# EAGLE design 3.7LiPoly Management 2.1 (EAGLE 9.3.1)
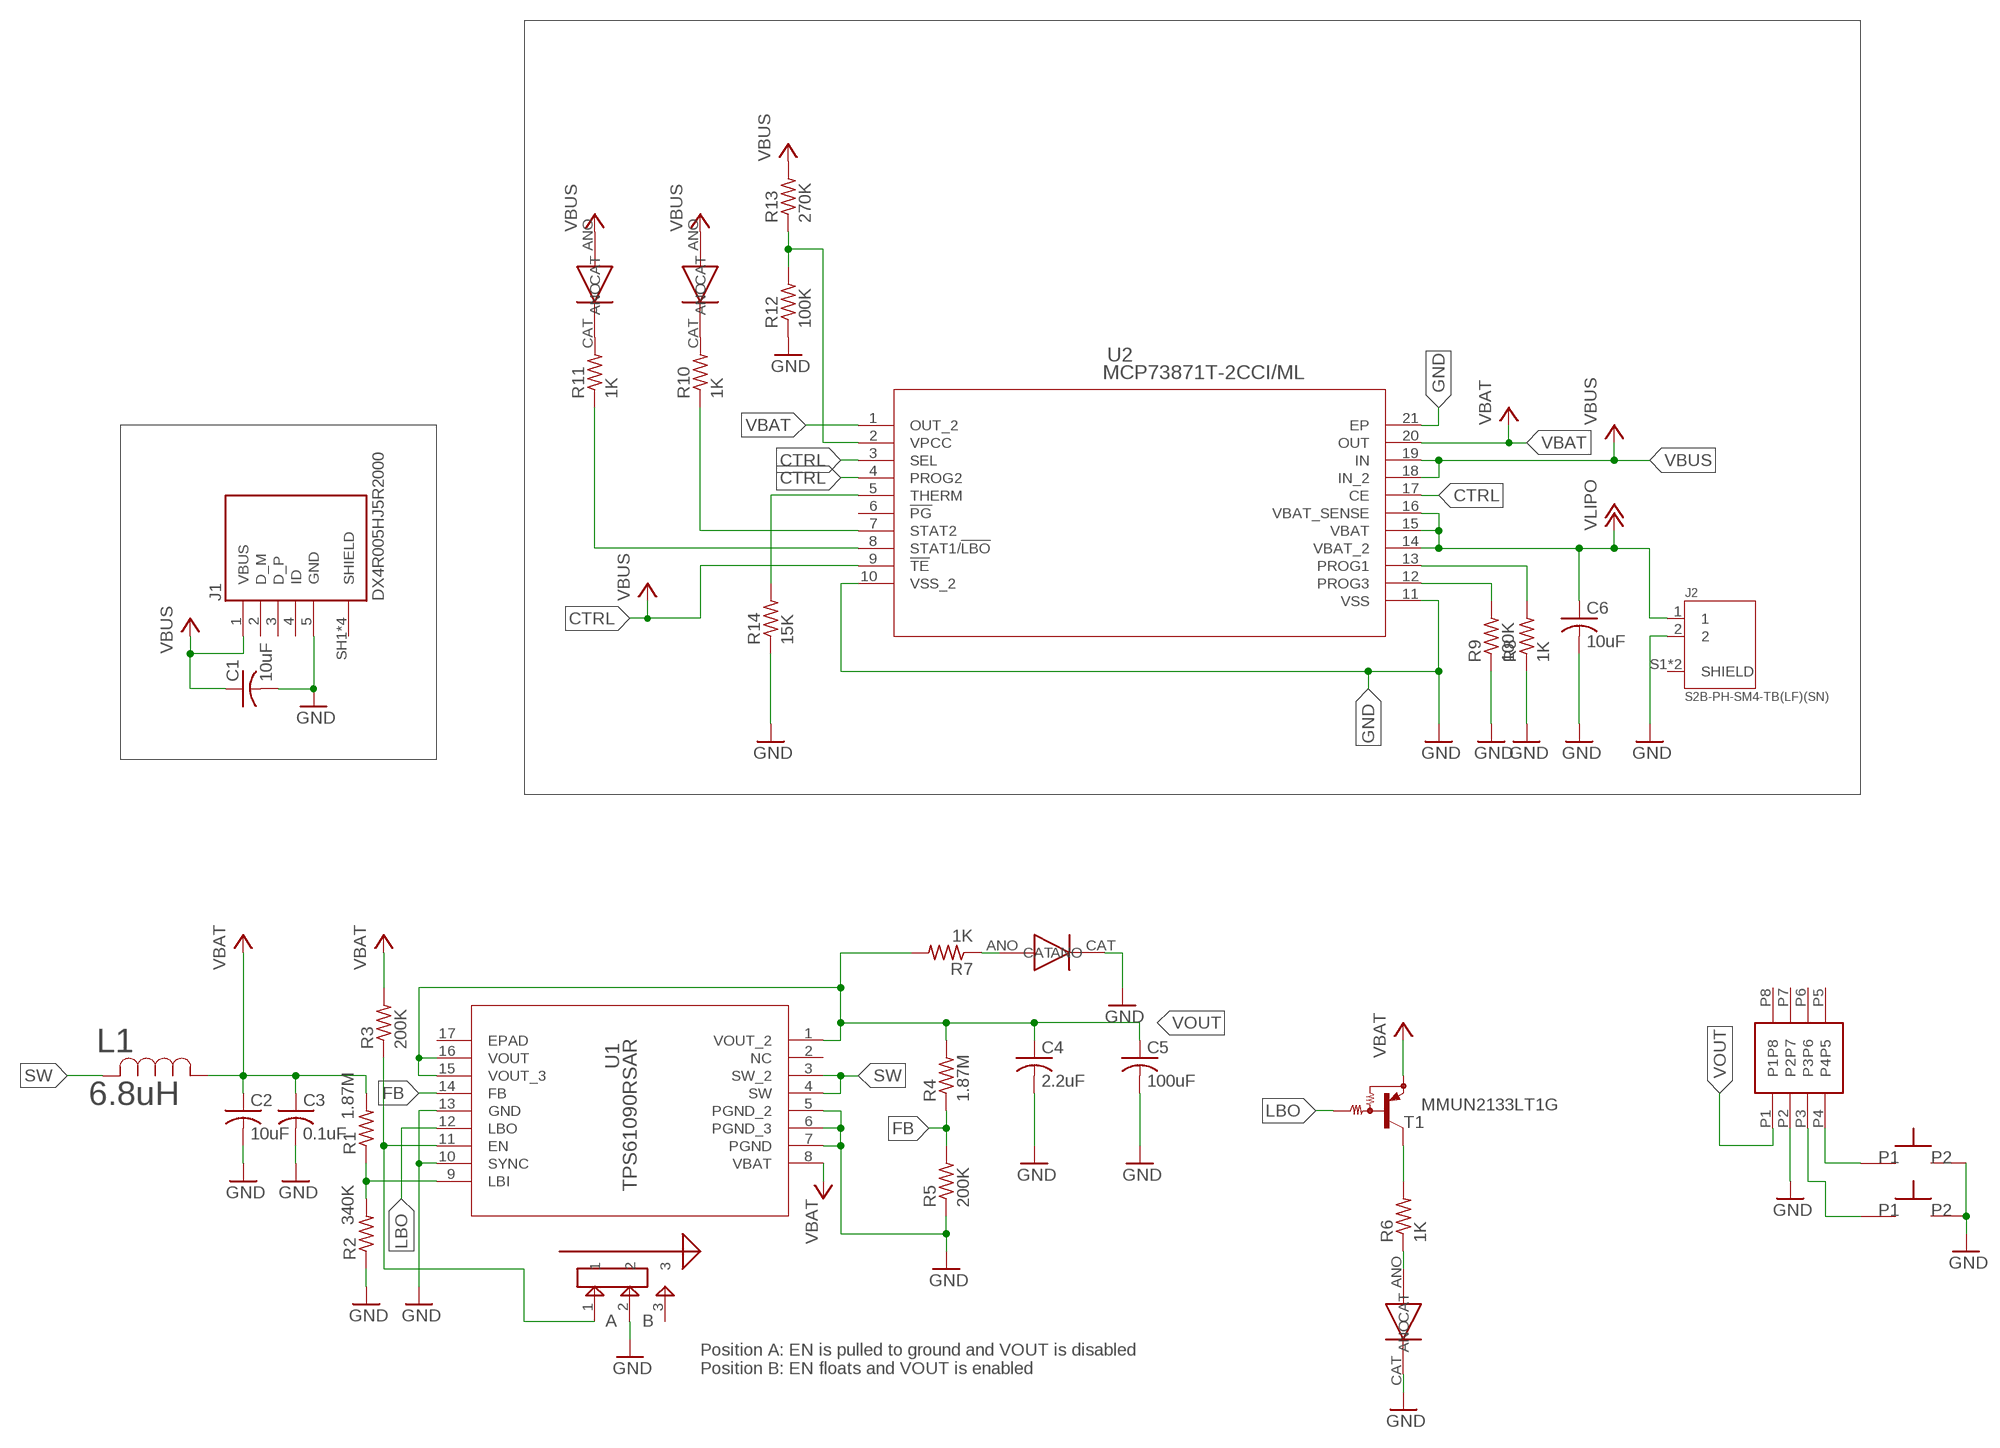
[diagram p0: schematic, sheet 1]

## Parts
C1  10uF  C-USC0805  [C0805]
C2  10uF  C-USC0805  [C0805]
C3  0.1uF  C-USC0805  [C0805]
C4  2.2uF  C-USC0805  [C0805]
C5  100uF  C-USC0805  [C0805]
C6  10uF  C-USC0805  [C0805]
CHARGE  YELLOW  WP934AD  [WP934AD]
DONE  GREEN  WP934AD  [WP934AD]
H1  M22-6340442  [M22-6340442]
J1  DX4R005HJ5R2000  [JAE_DX4R005HJ5R2000]
J2  S2B-PH-SM4-TB(LF)(SN)  [JST_S2B-PH-SM4-TB(LF)(SN)]
L1  6.8uH  VLCF5020T  [IND_5028]
LBO  RED  WP934AD  [WP934AD]
POWERON  BLUE  WP934EW  [WP934EW]
R1  1.87M  R-US_R0805  [R0805]
R2  340K  R-US_R0805  [R0805]
R3  200K  R-US_R0805  [R0805]
R4  1.87M  R-US_R0805  [R0805]
R5  200K  R-US_R0805  [R0805]
R6  1K  R-US_R0805  [R0805]
R7  1K  R-US_R0805  [R0805]
R8  1K  R-US_R0805  [R0805]
R9  100K  R-US_R0805  [R0805]
R10  1K  R-US_R0805  [R0805]
R11  1K  R-US_R0805  [R0805]
R12  100K  R-US_R0805  [R0805]
R13  270K  R-US_R0805  [R0805]
R14  15K  R-US_R0805  [R0805]
T1  MMUN2133LT1G  MUN2114T1-PNP_DRIVER-SC59-BEC  [SC59-BEC]
U1  TPS61090RSAR  [RSA16_2P7X2P7]
U2  MCP73871T-2CCI/ML  [QFN20_4X4MC]
U$1  SPST_TACTILE_SWITCHRIGHTANGLEBENT  [SPST_TACTILESWITCH_TL3360CF185Q_BENTFRAME]
U$2  JS102011SAQN  [JS102011SAQN]
U$3  SPST_TACTILE_SWITCHRIGHTANGLEBENT  [SPST_TACTILESWITCH_TL3360CF185Q_BENTFRAME]

## Nets
+3V3: CHARGE.ANO DONE.ANO R13.2 ; supply symbol labelled VBUS
CTRL: U2.3(SEL) U2.4(PROG2) U2.9(!TE) U2.17(CE) ; supply symbol labelled VBUS
FB: R4.1 R5.2 U1.14(FB)
GND: C1.2 C2.2 C3.2 C4.2 C5.2 C6.2 H1.P2 J1.5(GND) J2.2 LBO.CAT POWERON.CAT R2.1 R5.1 R8.1 R9.1 R12.1 R14.1 U1.5(PGND_2) U1.6(PGND_3) U1.7(PGND) U1.10(SYNC) U1.13(GND) U2.10(VSS_2) U2.11(VSS) U2.21(EP) U$1.P$2 U$2.2 U$3.P$2
LBO: T1.B U1.12(LBO)
N$1: R1.1 R2.2 U1.9(LBI)
N$2: R3.1 U1.11(EN) U$2.1
N$3: CHARGE.CAT R11.2
N$4: R8.2 U2.13(PROG1)
N$5: R6.2 T1.C
N$6: LBO.ANO R6.1
N$7: POWERON.ANO R7.1
N$8: R9.2 U2.12(PROG3)
N$9: DONE.CAT R10.2
N$10: H1.P4 U$3.P$1
N$11: R11.1 U2.8(STAT1/!LBO)
N$12: R10.1 U2.7(STAT2)
N$13: R14.2 U2.5(THERM)
N$14: R12.2 R13.1 U2.2(VPCC)
N$15: H1.P3 U$1.P$1
SW: L1.2 U1.3(SW_2) U1.4(SW)
VBAT [VBAT]: C2.1 C3.1 L1.1 R1.2 R3.2 T1.E U1.8(VBAT) U2.1(OUT_2) U2.20(OUT)
VBUS: C1.1 J1.1(VBUS) U2.18(IN_2) U2.19(IN)
VLIPO: C6.1 J2.1 U2.14(VBAT_2) U2.15(VBAT) U2.16(VBAT_SENSE)
VOUT: C4.1 C5.1 H1.P1 R4.2 R7.2 U1.1(VOUT_2) U1.15(VOUT_3) U1.16(VOUT)
Unconnected: H1.P5 H1.P6 H1.P7 H1.P8 J1.2(D_M) J1.3(D_P) J1.4(ID) J1.SH1(SHIELD) J1.SH2(SHIELD) J1.SH3(SHIELD) J1.SH4(SHIELD) J2.S1(SHIELD) J2.S2(SHIELD) U1.2(NC) U1.17(EPAD) U2.6(!PG) U$2.3

## Notes on the sheet
- A | B
- Position A: EN is pulled to ground and VOUT is disabled
  Position B: EN floats and VOUT is enabled

## Library data of the parts
C1-C6 = rcl:C-US: CAPACITOR, American symbol; SPICEPREFIX: C
CHARGE DONE LBO = KingBright:WP934AD: LED Circuit Board Indicators 3mm RA. CBI LED INDICATOR
H1 = M22-6340442:M22-6340442: 8 Pin Header 2.0mm pitch
J1 = DX4R005HJ5R2000:DX4R005HJ5R2000: RCPT MICRO USB 2.0 B SMT H/D; DESCRIPTION: DX4 series, receptacle, on-board, right-angle standard mount, surface mount; MF: JAE Electronics; MP: DX4R005HJ5R2000; PACKAGE: None
J2 = S2B-PH-SM4-TB_LF__SN_:S2B-PH-SM4-TB(LF)(SN): PH Series 2 Position 2 mm Pitch Surface Mount Side Entry Shrouded Header; DESCRIPTION: PH Series 2 Position 2 mm Pitch Surface Mount Side Entry Shrouded Header; MF: JST Sales; MP: S2B-PH-SM4-TB_LF__SN_; PACKAGE: FakePackage u
L1 = VLCF5020T-6R8N1R1:VLCF5020T
POWERON = KingBright:WP934EW: LED Circuit Board Indicators 3mm RA HOUSING LED
R1-R14 = rcl:R-US_: RESISTOR, American symbol; SPICEPREFIX: R
T1 = transistor:*-PNP_DRIVER-: PNP Bias Resistor Transistor
U1 = TPS61090RSAR:TPS61090RSAR; MANUFACTURER_PART_NUMBER: TPS61090RSAR; VENDOR: Texas Instruments
U2 = MCP73871T-2CCI:MCP73871T-2CCI/ML: Stand-Alone System Load Sharing and Li-Ion/Li-Polymer Battery Charge Management Controller; MANUFACTURER_PART_NUMBER: MCP73871T2CCIML; VENDOR: Microchip
U$1 U$3 = switches:SPST_TACTILE_SWITCH: SMD SPST Tactile Switch
U$2 = JS102011SAQN:JS102011SAQN: SPDT SMD Right Angle Switch

## Board
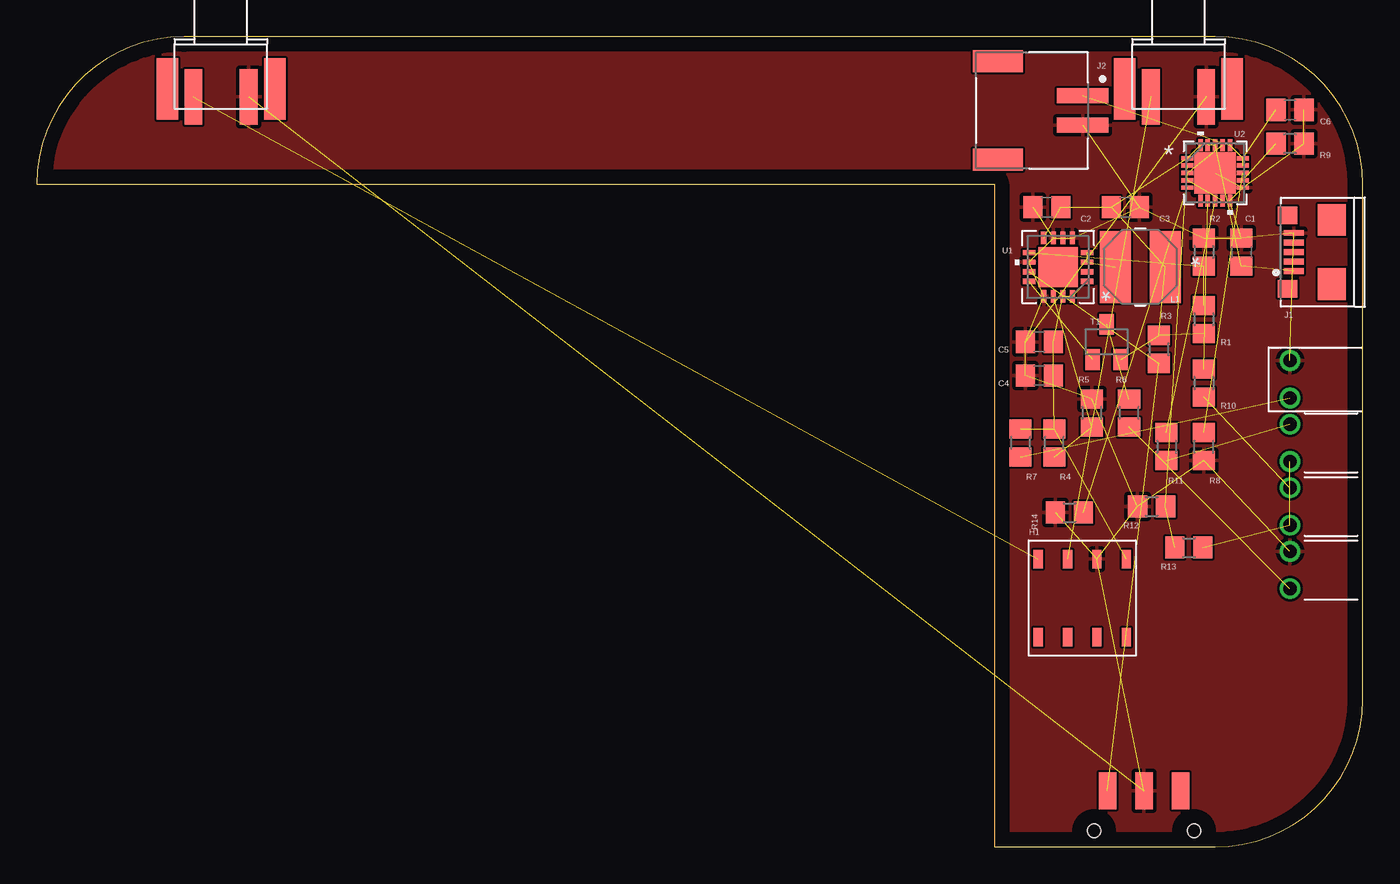
[diagram p1: board, top side]
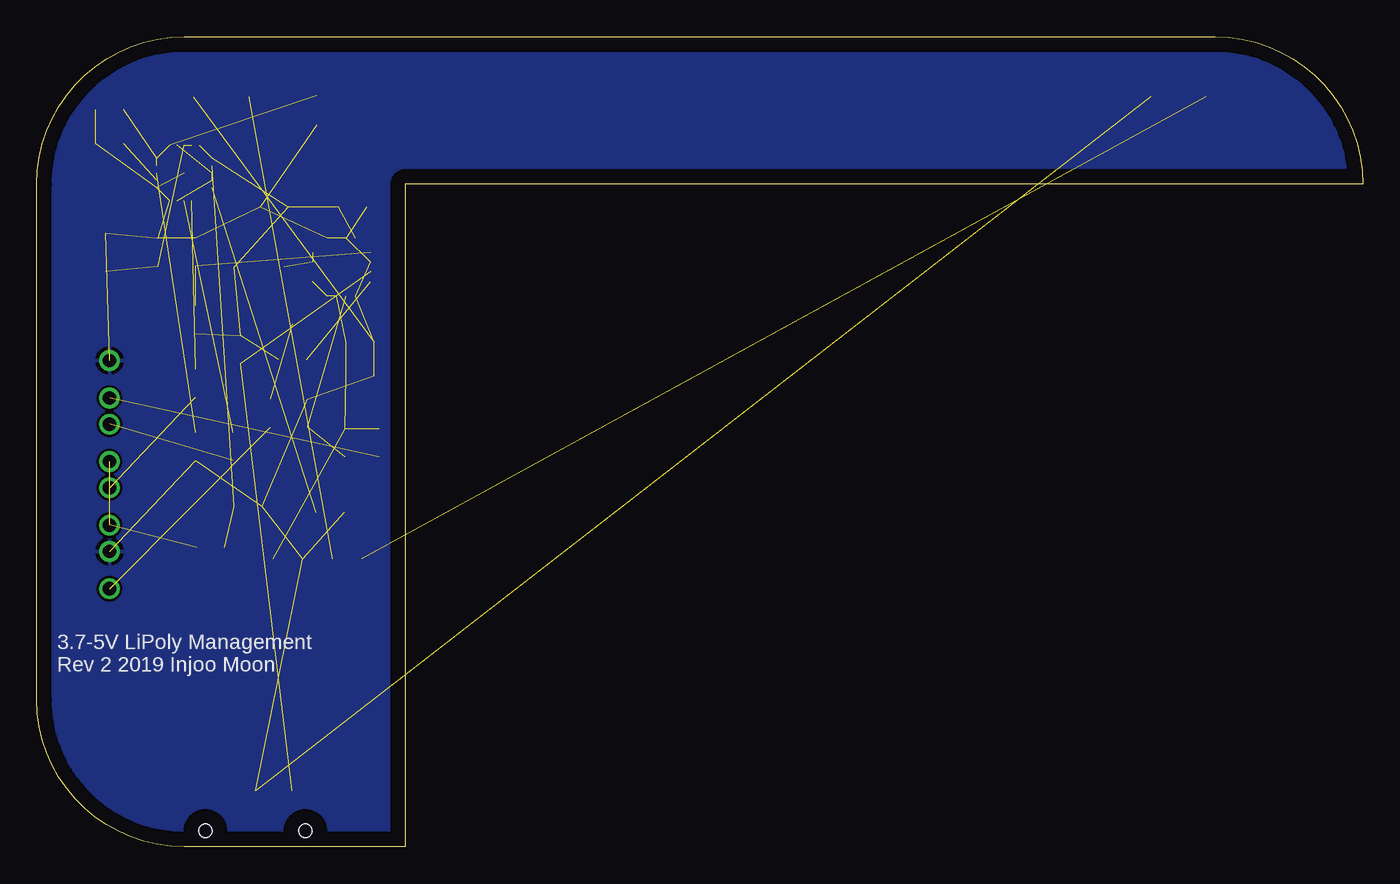
[diagram p2: board, bottom side, seen from below]

Size 90 x 55 mm. Coordinates in mm from the lower left corner, seen from the top.
Outline: 65,0 80,0 arc90 90,10 90,45 arc90 80,55 10,55 arc90 0,45 65,45 65,0
Copper layers (1*16): Top 0.035mm / dielectric 1.5mm / Bottom 0.035mm
Design rules "default": minimum track width 6mil, minimum drill 0.35mm, track to track 6mil, track to pad 6mil, pad to pad 6mil, via to via 6mil, smd to smd 6mil, copper to edge 40mil, drill to drill 6mil, minimum pad ring 10mil, minimum via ring 8mil, stop-mask expansion 4mil, vias tented up to drill 0mil, thermal gap 10mil

### Footprints (pad centres in the part's own frame; a part is rotated, then mirrored left to right if it is on the bottom)
C0805 = smd 1.3 x 1.5: 1 -0.95,0; 2 0.95,0
WP934AD = drill 0.9: ANO -1.27,0; CAT 1.27,0
M22-6340442 = smd 1.27 x 0.635: P1 -2.54,2.54; P2 -2.54,0.54; P3 -2.54,-1.46; P4 -2.54,-3.46; P5 2.76,-3.46; P6 2.76,-1.46; P7 2.76,0.54; P8 2.76,2.54
JAE_DX4R005HJ5R2000 = smd 0.4 x 1.35: 1 -1.3,0; 2 -0.65,0; 3 0,0; 4 0.65,0; 5 1.3,0 | smd 1.2 x 1.3: SH1 -2.5,0.425; SH2 2.5,0.425 | smd 2.15 x 1.9: SH3 -2.175,-2.575; SH4 2.175,-2.575
JST_S2B-PH-SM4-TB(LF)(SN) = smd 1 x 3.5: 1 -1,0; 2 1,0 | smd 1.5 x 3.4: S1 -3.35,-5.75; S2 3.35,-5.75
IND_5028 = smd 2.1 x 4.9: 1 -1.7,0; 2 1.7,0
WP934EW = drill 0.9: ANO -1.27,0; CAT 1.27,0
R0805 = smd 1.3 x 1.5: 1 -0.95,0; 2 0.95,0
SC59-BEC = smd 1 x 1.4: B -0.95,-1.2; C 0,1.2; E 0.95,-1.2
RSA16_2P7X2P7 = smd 0.85 x 0.35: 1 -1.975,0.975; 2 -1.975,0.325; 3 -1.975,-0.325; 4 -1.975,-0.975; 9 1.975,-0.975; 10 1.975,-0.325; 11 1.975,0.325; 12 1.975,0.975 | smd 0.35 x 0.85: 5 -0.975,-1.975; 6 -0.325,-1.975; 7 0.325,-1.975; 8 0.975,-1.975; 13 0.975,1.975; 14 0.325,1.975; 15 -0.325,1.975; 16 -0.975,1.975 | smd 2.692 x 2.692: 17 0,0
QFN20_4X4MC = smd 0.813 x 0.305: 1 -1.892,1; 2 -1.892,0.5; 3 -1.892,0; 4 -1.892,-0.5; 5 -1.892,-1; 11 1.892,-1; 12 1.892,-0.5; 13 1.892,0; 14 1.892,0.5; 15 1.892,1 | smd 0.305 x 0.813: 6 -1,-1.892; 7 -0.5,-1.892; 8 0,-1.892; 9 0.5,-1.892; 10 1,-1.892; 16 1,1.892; 17 0.5,1.892; 18 0,1.892; 19 -0.5,1.892; 20 -1,1.892 | smd 2.794 x 2.794: 21 0,0
SPST_TACTILESWITCH_TL3360CF185Q_BENTFRAME = smd 1.46 x 4.19: FRAME1 -3.65,-3.035; FRAME2 3.65,-3.035 | smd 1.205 x 3.76: P$1 -1.873,-3.58; P$2 1.873,-3.58
JS102011SAQN = smd 1.194 x 2.515: 1 -2.477,2.527; 2 0,2.54; 3 2.489,2.54 | hole 0.9: -3.391,-0.178; 3.391,-0.178

### Placement (x,y rotation side)
C1  81.76,40.39 90 top
C2  68.56,43.43 180 top
C3  73.89,43.43 0 top
C4  68.05,32 180 top
C5  68.05,34.29 180 top
C6  85.07,50.04 0 top
CHARGE  85.07,27.43 90 top
DONE  85.07,23.11 90 top
H1  71.42,17 270 top
J1  85.32,40.39 90 top
J2  71,50 270 top
L1  74.91,39.37 180 top
LBO  85.07,18.8 90 top
POWERON  85.07,31.75 90 top
R1  79.22,35.81 270 top
R2  79.22,40.39 270 top
R3  76.18,33.78 90 top
R4  69.06,27.43 90 top
R5  71.6,29.46 270 top
R6  74.14,29.46 90 top
R7  66.78,27.43 90 top
R8  79.22,27.18 90 top
R9  85.07,47.75 180 top
R10  79.22,31.5 270 top
R11  76.68,27.18 270 top
R12  75.67,23.11 0 top
R13  78.21,20.32 0 top
R14  70.1,22.7 0 top
T1  72.62,34.29 0 top
U1  69.32,39.37 180 top
U2  79.99,45.76 0 top
U$1  77.5,54.5 0 top
U$2  75.16,1.27 0 top
U$3  12.5,54.5 0 top

### Tracks (layer width: path | path; a pad name or v marks a point on that pad's centre or on a via)
+3V3  (2 unrouted)
CTRL  (3 unrouted)
FB  (2 unrouted)
GND  (27 unrouted)
  pour Bottom (rank 6): -1.78,56.9 93.45,56.9 93.45,-3.05 -1.78,-3.05
  pour Top (rank 6): -2.29,57.4 93.96,57.4 93.96,-3.56 -2.29,-3.56
LBO  (1 unrouted)
N$1  (2 unrouted)
N$2  (2 unrouted)
N$3  (1 unrouted)
N$4  (1 unrouted)
N$5  (1 unrouted)
N$6  (1 unrouted)
N$7  (1 unrouted)
N$8  (1 unrouted)
N$9  (1 unrouted)
N$10  (1 unrouted)
N$11  (1 unrouted)
N$12  (1 unrouted)
N$13  (1 unrouted)
N$14  (2 unrouted)
N$15  (1 unrouted)
SW  (2 unrouted)
VBAT  (8 unrouted)
VBUS  (3 unrouted)
VLIPO  (4 unrouted)
VOUT  (7 unrouted)

### Text on the board
bNames: 3.7-5V LiPoly Management / Rev 2 2019 Injoo Moon